# EAGLE design PSU (EAGLE 7.2.0)
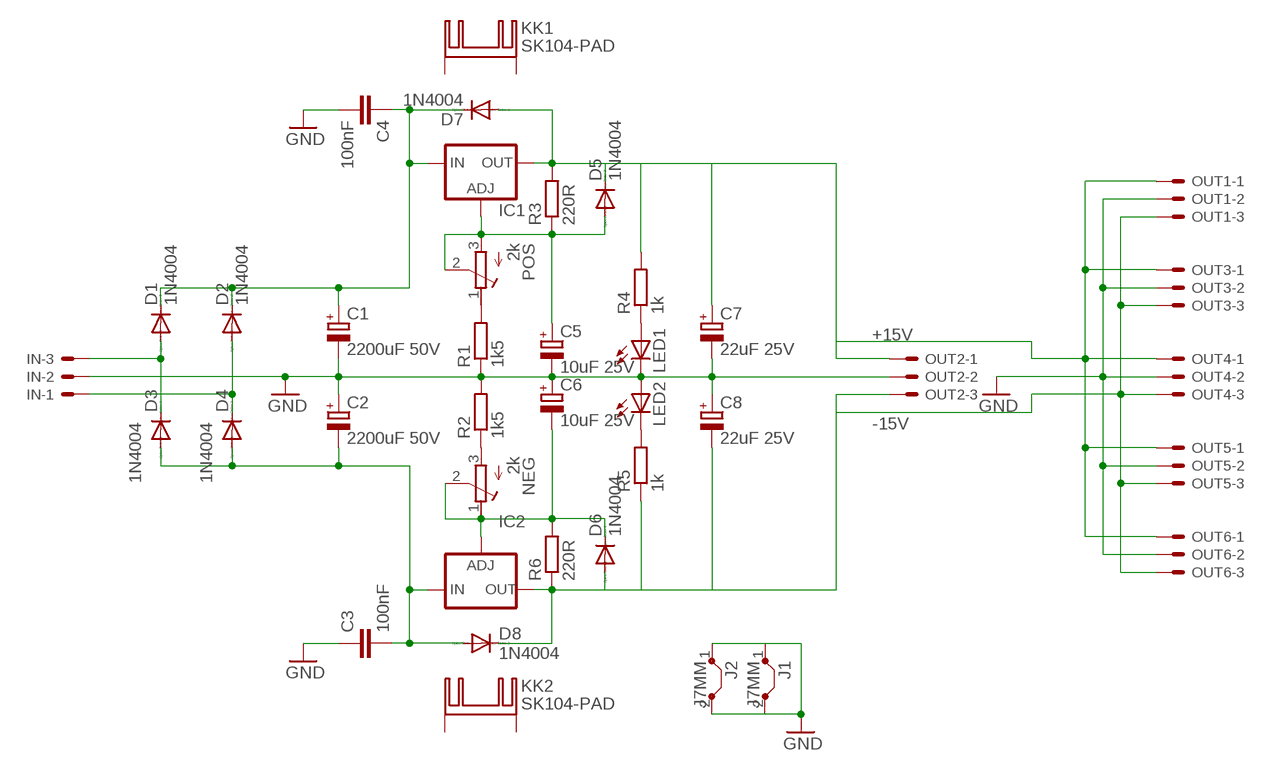
[diagram p0: schematic, sheet 1]

## Parts
C1  2200uF 50V  CPOL-EUE7.5-16  [E7,5-16]
C2  2200uF 50V  CPOL-EUE7.5-16  [E7,5-16]
C3  100nF  C-EU050-025X075  [C050-025X075]
C4  100nF  C-EU050-025X075  [C050-025X075]
C5  10uF 25V  CPOL-EUE2.5-5  [E2,5-5]
C6  10uF 25V  CPOL-EUE2.5-5  [E2,5-5]
C7  22uF 25V  CPOL-EUE2.5-5  [E2,5-5]
C8  22uF 25V  CPOL-EUE2.5-5  [E2,5-5]
D1  1N4004  [DO41-10]
D2  1N4004  [DO41-10]
D3  1N4004  [DO41-10]
D4  1N4004  [DO41-10]
D5  1N4004  [DO41-10]
D6  1N4004  [DO41-10]
D7  1N4004  [DO41-10]
D8  1N4004  [DO41-10]
IC1  LM317TS  [317TS]
IC2  LM337TS  [337TS]
IN  KK-156-3  [KK-156-3]
J1  J7MM  [07]
J2  J7MM  [07]
KK1  SK104-PAD  [SK104-PAD]
KK2  SK104-PAD  [SK104-PAD]
LED1  LED3MM  [LED3MM]
LED2  LED3MM  [LED3MM]
NEG  2k  R-TRIMMT93YA  [RTRIMT93YA]
OUT1  KK-156-3  [KK-156-3]
OUT2  KK-156-3  [KK-156-3]
OUT3  KK-156-3  [KK-156-3]
OUT4  KK-156-3  [KK-156-3]
OUT5  KK-156-3  [KK-156-3]
OUT6  KK-156-3  [KK-156-3]
POS  2k  R-TRIMMT93YA  [RTRIMT93YA]
R1  1k5  R-EU_0207/7  [0207/7]
R2  1k5  R-EU_0207/7  [0207/7]
R3  220R  R-EU_0207/7  [0207/7]
R4  1k  R-EU_0207/7  [0207/7]
R5  1k  R-EU_0207/7  [0207/7]
R6  220R  R-EU_0207/7  [0207/7]

## Nets
+15V: C7.+ D5.C D7.A IC1.2(OUT) OUT1.1 OUT2.1 OUT3.1 OUT4.1 OUT5.1 OUT6.1 R3.2 R4.2
-15V: C8.- D6.A D8.C IC2.3(OUT) OUT1.3 OUT2.3 OUT3.3 OUT4.3 OUT5.3 OUT6.3 R5.1 R6.1
GND: C1.- C2.+ C3.1 C4.2 C5.- C6.+ C7.- C8.+ IN.2 J1.1 J1.2 J2.1 J2.2 LED1.K(C) LED2.A OUT1.2 OUT2.2 OUT3.2 OUT4.2 OUT5.2 OUT6.2 R1.1 R2.2
N$5: LED1.A R4.1
N$7: LED2.K(C) R5.2
N$9: POS.1(E) R1.2
N$10: C5.+ D5.A IC1.1(ADJ) POS.2(S) POS.3(A) R3.1
N$11: NEG.3(A) R2.1
N$12: C6.- D6.C IC2.1(ADJ) NEG.1(E) NEG.2(S) R6.2
N$13: C2.- C3.2 D3.A D4.A D8.A IC2.2(IN)
N$16: C1.+ C4.1 D1.C D2.C D7.C IC1.3(IN)
N$21: D2.A D4.C IN.1
N$22: D1.A D3.C IN.3
Unconnected: KK1.K1(K) KK1.K2(K) KK2.K1(K) KK2.K2(K)

## Library data of the parts
C1 C2 C5-C8 = resistor:CPOL-EU: POLARIZED CAPACITOR, European symbol
C3 C4 = resistor:C-EU: CAPACITOR, European symbol
D1-D8 = diode:1N4004: DIODE general purpose rectifier, 1 A
IC1 = v-reg:LM317TS: VOLTAGE REGULATOR
IC2 = v-reg:LM337TS: VOLTAGE REGULATOR
IN OUT1-OUT6 = con-molex:KK-156-3: KK 156 HEADER Source: http://www.molex.com/pdm_docs/sd/026604100_sd.pdf; OC_FARNELL: unknown; OC_NEWARK: unknown
J1 J2 = jumper:J: Bridge
KK1 KK2 = heatsink:SK104-PAD: HEATSINK manufacturer Fischer/distributor Buerklin
LED1 LED2 = led:LED: LED OSRAM: - CHIPLED LG R971, LG N971, LY N971, LG Q971, LY Q971, LO R971, LY R971 LH N974, LH R974 LS Q976, LO Q976, LY Q976 LO Q996 - Hyper CHIPLED LW Q18S LB Q993, LB Q99A, LB R99A - SideLED LS A670, LO A670, LY A670, LG A670, LP A670 LB A673, LV A673, LT A673, LW A673 LH A674 LY A675 LS A676, LA A676, LO A676, LY A676, LW A676 LS A679, LY A679, LG A679 - Hyper Micro SIDELED® LS Y876, LA Y876, LO Y876, LY Y876 LT Y87S - SmartLED LW L88C, LW L88S LB L89C, LB L89S, LG L890 LS L89K, LO L89K, LY L89K LS L896, LA L896, LO L896, LY L896 - TOPLED LS T670, LO T670, LY T670, LG T670, LP T670 LSG T670, LSP T670, LSY T670, LOP T670, LYG T670 LG T671, LOG T671, LSG T671 LB T673, LV T673, LT T673, LW T673 LH T674 LS T676, LA T676, LO T676, LY T676, LB T676, LH T676, LSB T676, LW T676 LB T67C, LV T67C, LT T67C, LS T67K, LO T67K, LY T67K, LW E67C LS E67B, LA E67B, LO E67B, LY E67B, LB E67C, LV E67C, LT E67C LW T67C LS T679, LY T679, LG T679 LS T770, LO T770, LY T770, LG T770, LP T770 LB T773, LV T773, LT T773, LW T773 LH T774 LS E675, LA E675, LY E675, LS T675 LS T776, LA T776, LO T776, LY T776, LB T776 LHGB T686 LT T68C, LB T68C - Hyper Mini TOPLED® LB M676 - Mini TOPLED Santana® LG M470 LS M47K, LO M47K, LY M47K Source: http://www.osram.convergy.de LUXEON: - LUMILED® LXK2-PW12-R00, LXK2-PW12-S00, LXK2-PW14-U00, LXK2-PW14-V00 LXK2-PM12-R00, LXK2-PM12-S00, LXK2-PM14-U00 LXK2-PE12-Q00, LXK2-PE12-R00, LXK2-PE12-S00, LXK2-PE14-T00, LXK2-PE14-U00 LXK2-PB12-K00, LXK2-PB12-L00, LXK2-PB12-M00, LXK2-PB14-N00, LXK2-PB14-P00, LXK2-PB14-Q00 LXK2-PR12-L00, LXK2-PR12-M00, LXK2-PR14-Q00, LXK2-PR14-R00 LXK2-PD12-Q00, LXK2-PD12-R00, LXK2-PD12-S00 LXK2-PH12-R00, LXK2-PH12-S00 LXK2-PL12-P00, LXK2-PL12-Q00, LXK2-PL12-R00 Source: www.luxeon.com KINGBRIGHT: KA-3528ASYC Source: www.kingbright.com
NEG POS = resistor:R-TRIMM: Trimm resistor
R1-R6 = resistor:R-EU_: RESISTOR, European symbol

## Board
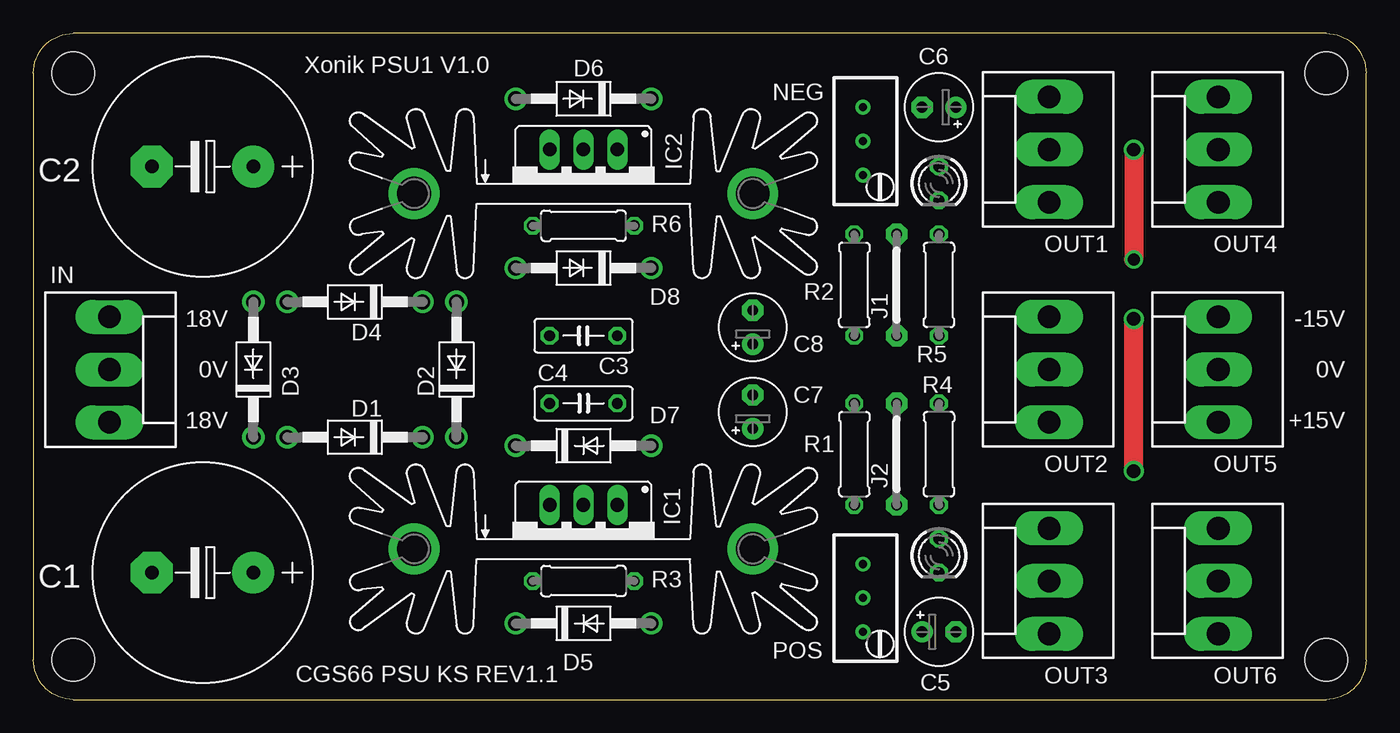
[diagram p1: board, top side]
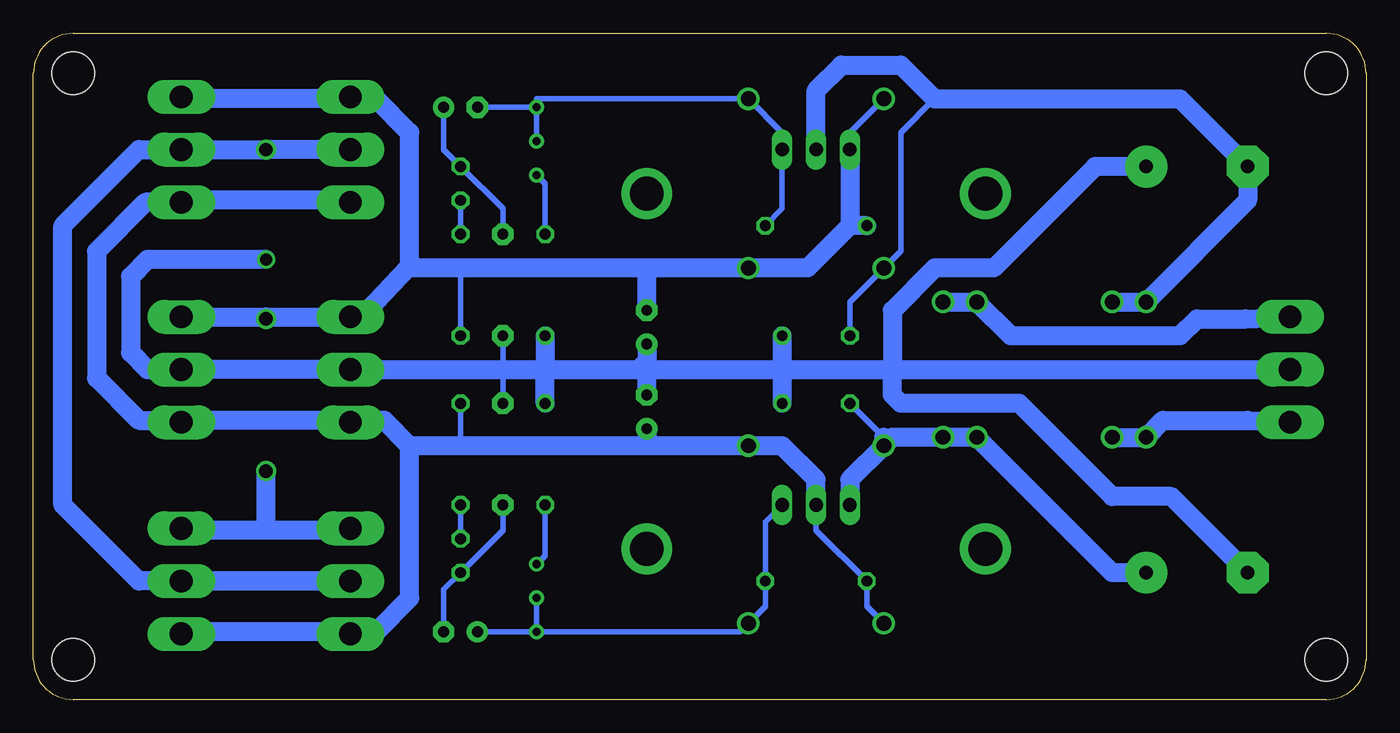
[diagram p2: board, bottom side, seen from below]

Size 100 x 50 mm. Coordinates in mm from the lower left corner, seen from the top.
Outline: 3,0 97,0 arc90 100,3 100,47 arc90 97,50 3,50 arc90 0,47 0,3 arc90 3,0
Copper layers (1*16): Top 0.035mm / dielectric 1.5mm / Bottom 0.035mm
Design rules "default": minimum track width 10mil, minimum drill 24mil, track to track 8mil, track to pad 8mil, pad to pad 8mil, via to via 8mil, smd to smd 8mil, copper to edge 40mil, drill to drill 8mil, minimum pad ring 10mil, minimum via ring 8mil, stop-mask expansion 4mil, vias tented up to drill 0mil, thermal gap 10mil
Holes 3.2 mm at 3,47 97,3 3,3 97,47

### Footprints (pad centres in the part's own frame; a part is rotated, then mirrored left to right if it is on the bottom)
E7,5-16 = drill 1.016 pad 3.15: + -3.81,0 | drill 1.016 pad 3.15 octagon: - 3.81,0
C050-025X075 = drill 0.813 octagon: 1 -2.54,0; 2 2.54,0
E2,5-5 = drill 0.813 pad 1.6: + -1.27,0 | drill 0.813 pad 1.6 octagon: - 1.27,0
DO41-10 = drill 1.118: A 5.08,0; C -5.08,0
317TS = drill 1.016 long: 1 -2.54,-2.54; 2 0,-2.54; 3 2.54,-2.54
337TS = drill 1.016 long: 1 -2.54,-2.54; 2 0,-2.54; 3 2.54,-2.54
KK-156-3 = drill 1.7 pad 2.184 long: 1 -3.96,0; 2 0,0; 3 3.96,0
07 = drill 0.813 pad 1.6 octagon: 1 -3.81,0; 2 3.81,0
SK104-PAD = drill 2.54 pad 3.81: K1 -12.7,-0.762; K2 12.7,-0.762
LED3MM = drill 0.813 octagon: A -1.27,0; K 1.27,0
RTRIMT93YA = drill 0.61: 1 0,-2.54; 2 0,0; 3 0,2.54
0207/7 = drill 0.813 octagon: 1 -3.81,0; 2 3.81,0

### Placement (x,y rotation side)
C1  12.7,9.53 180 top
C2  12.7,40.01 180 top
C3  41.27,27.3 180 top
C4  41.27,22.23 0 top
C5  67.94,5.08 0 top
C6  67.94,44.45 180 top
C7  53.98,21.59 90 top
C8  53.98,27.94 90 top
D1  24.13,19.68 180 top
D2  31.75,24.77 90 top
D3  16.51,24.77 90 top
D4  24.13,29.84 180 top
D5  41.27,5.71 0 top
D6  41.27,45.09 180 top
D7  41.27,19.05 0 top
D8  41.27,32.38 180 top
IC1  41.27,12.06 180 top
IC2  41.27,38.73 180 top
IN  5.71,24.77 270 top
J1  64.77,31.11 90 top
J2  64.77,18.41 90 top
KK1  41.27,12.06 0 top
KK2  41.27,38.73 0 top
LED1  67.94,10.79 270 top
LED2  67.94,38.73 270 top
NEG  62.23,41.91 180 top
OUT1  76.2,41.27 90 top
OUT2  76.2,24.77 90 top
OUT3  76.2,8.89 90 top
OUT4  88.9,41.27 90 top
OUT5  88.9,24.77 90 top
OUT6  88.9,8.89 90 top
POS  62.23,7.62 180 top
R1  61.59,18.41 270 top
R2  61.59,31.11 270 top
R3  41.27,8.89 180 top
R4  67.94,18.41 90 top
R5  67.94,31.11 90 top
R6  41.27,35.56 0 top

### Tracks (layer width: path | path; a pad name or v marks a point on that pad's centre or on a via)
+15V
  Bottom 0.406: D5.C 37.47,6.99 R3.2 41.27,12.7 IC1.2 | R4.2 67.94,19.05
  Bottom 1.422: IC1.2 41.27,16.51 43.81,19.05 D7.A 53.98,19.05 | C7.+ 53.98,19.05 | 53.98,19.05 67.94,19.05 71.75,19.05 | 71.75,19.05 73.66,20.95 75.56,20.95 OUT2.1 76.69,20.8 76.83,20.95 89.05,20.95 | 71.75,19.05 71.75,7.62 74.3,5.08 76.05,5.08 OUT3.1 76.69,4.93 76.83,5.08 88.75,5.08 OUT6.1 | OUT1.1 76.69,37.31 76.83,37.47 88.75,37.47 OUT4.1 91.59,37.31 95.25,33.66 95.25,24.13 92.08,20.95 89.05,20.95 | 89.05,20.95 OUT5.1
-15V  (via drill 1)
  Top 1.422: v82.55,17.14 v82.55,28.57
  Bottom 0.406: D6.A 38.73,42.55 IC2.3 | R5.1 67.94,32.38
  Bottom 1.422: IC2.3 38.73,35.56 | 38.73,35.56 41.91,32.38 D8.C 53.98,32.38 | R6.1 38.73,35.56 | C8.- 53.98,32.38 | 53.98,32.38 67.94,32.38 71.75,32.38 | 82.55,28.73 OUT5.3 89.39,29.21 | 82.55,28.73 OUT2.3 75.42,28.73 74.93,29.21 71.91,32.38 71.75,32.38 | OUT3.3 76.69,12.85 76.83,12.7 82.55,12.7 | 82.55,12.7 88.75,12.7 OUT6.3 | OUT1.3 76.69,45.23 76.83,45.09 | 76.83,45.09 88.75,45.09 OUT4.3 | 71.75,32.38 71.75,42.55 74.3,45.09 76.83,45.09 | 82.55,12.7 v82.55,17.14 | v82.55,28.57 82.55,28.73
GND  (via drill 0.9, 1)
  Top 0.406: J1.2 J1.1 | J2.1 J2.2
  Top 1.422: v82.55,41.27 v82.55,33.02
  Bottom 0.406: C6.+ 69.22,41.27 LED2.A 64.77,36.83 J1.2 | C5.- 69.22,8.26 LED1.K 64.77,12.7 J2.1 | J1.1 64.77,24.77 J2.2
  Bottom 1.422: 61.59,24.77 64.77,24.77 OUT2.2 OUT5.2 91.44,24.77 92.71,26.04 92.71,31.75 91.44,33.02 v82.55,33.02 | 61.59,24.77 54.61,24.77 | 54.61,24.77 53.98,24.77 | 53.98,24.77 43.81,24.77 | 43.81,24.77 35.56,24.77 | 35.56,24.77 IN.2 | C1.- 14.61,15.24 19.05,15.24 26.04,22.23 34.92,22.23 35.56,22.86 35.56,24.77 | C2.+ 20.32,40.01 27.94,32.38 32.38,32.38 35.56,29.21 35.56,24.77 | C3.1 43.81,24.77 | 43.81,24.77 C4.2 | R2.2 61.59,24.77 | R1.1 61.59,24.77 | C8.+ 53.98,25.4 54.61,24.77 | C7.- 53.98,24.77 | OUT6.2 OUT3.2 92.08,8.89 97.79,14.61 97.79,35.56 92.08,41.27 OUT4.2 v82.55,41.27 OUT1.2
N$5
  Bottom 0.406: R4.1 LED1.A
N$7
  Bottom 0.406: R5.2 LED2.K
N$9
  Bottom 0.406: R1.2 61.59,10.79 POS.1
N$10
  Bottom 0.406: IC1.1 45.09,13.34 R3.1 45.09,6.99 D5.A 46.99,5.08 POS.3 | POS.3 POS.2 | POS.3 C5.+
N$11
  Bottom 0.406: R2.1 61.59,38.73 NEG.3
N$12
  Bottom 0.406: R6.2 43.81,36.83 IC2.1 43.81,42.55 D6.C 62.23,45.09 NEG.1 | NEG.1 NEG.2 | NEG.1 C6.-
N$13
  Bottom 0.406: 32.38,45.09 34.92,42.55 34.92,33.66 D8.A 38.73,29.84 C3.2
  Bottom 1.422: D4.A D3.A 8.89,37.47 C2.- 13.97,45.09 32.38,45.09 34.92,47.62 39.37,47.62 41.27,45.72 IC2.2
N$16
  Bottom 0.406: C4.1 36.2,19.68
  Bottom 1.422: C1.+ 19.05,9.53 D1.C D2.C 35.56,19.68 D7.C | 36.2,19.68 D7.C | D7.C 38.73,16.51 IC1.3
N$21
  Bottom 1.422: D2.A D4.C 26.67,27.3 13.97,27.3 12.7,28.57 9.04,28.57 IN.1
N$22
  Bottom 1.422: D1.A D3.C 15.24,20.95 8.89,20.95 IN.3

### Text on the board
tNames: Xonik PSU1 V1.0 | 18V | -15V | 0V | 0V | 18V | +15V | CGS66 PSU KS REV1.1